# Altium schematic sheet DBG BOOT_CONF.SchDoc
size A2; DrawnBy: UKAYACIK; Engineer: UKAYACIK; DocumentNumber: 20; SheetNumber: 20; SheetTotal: 21
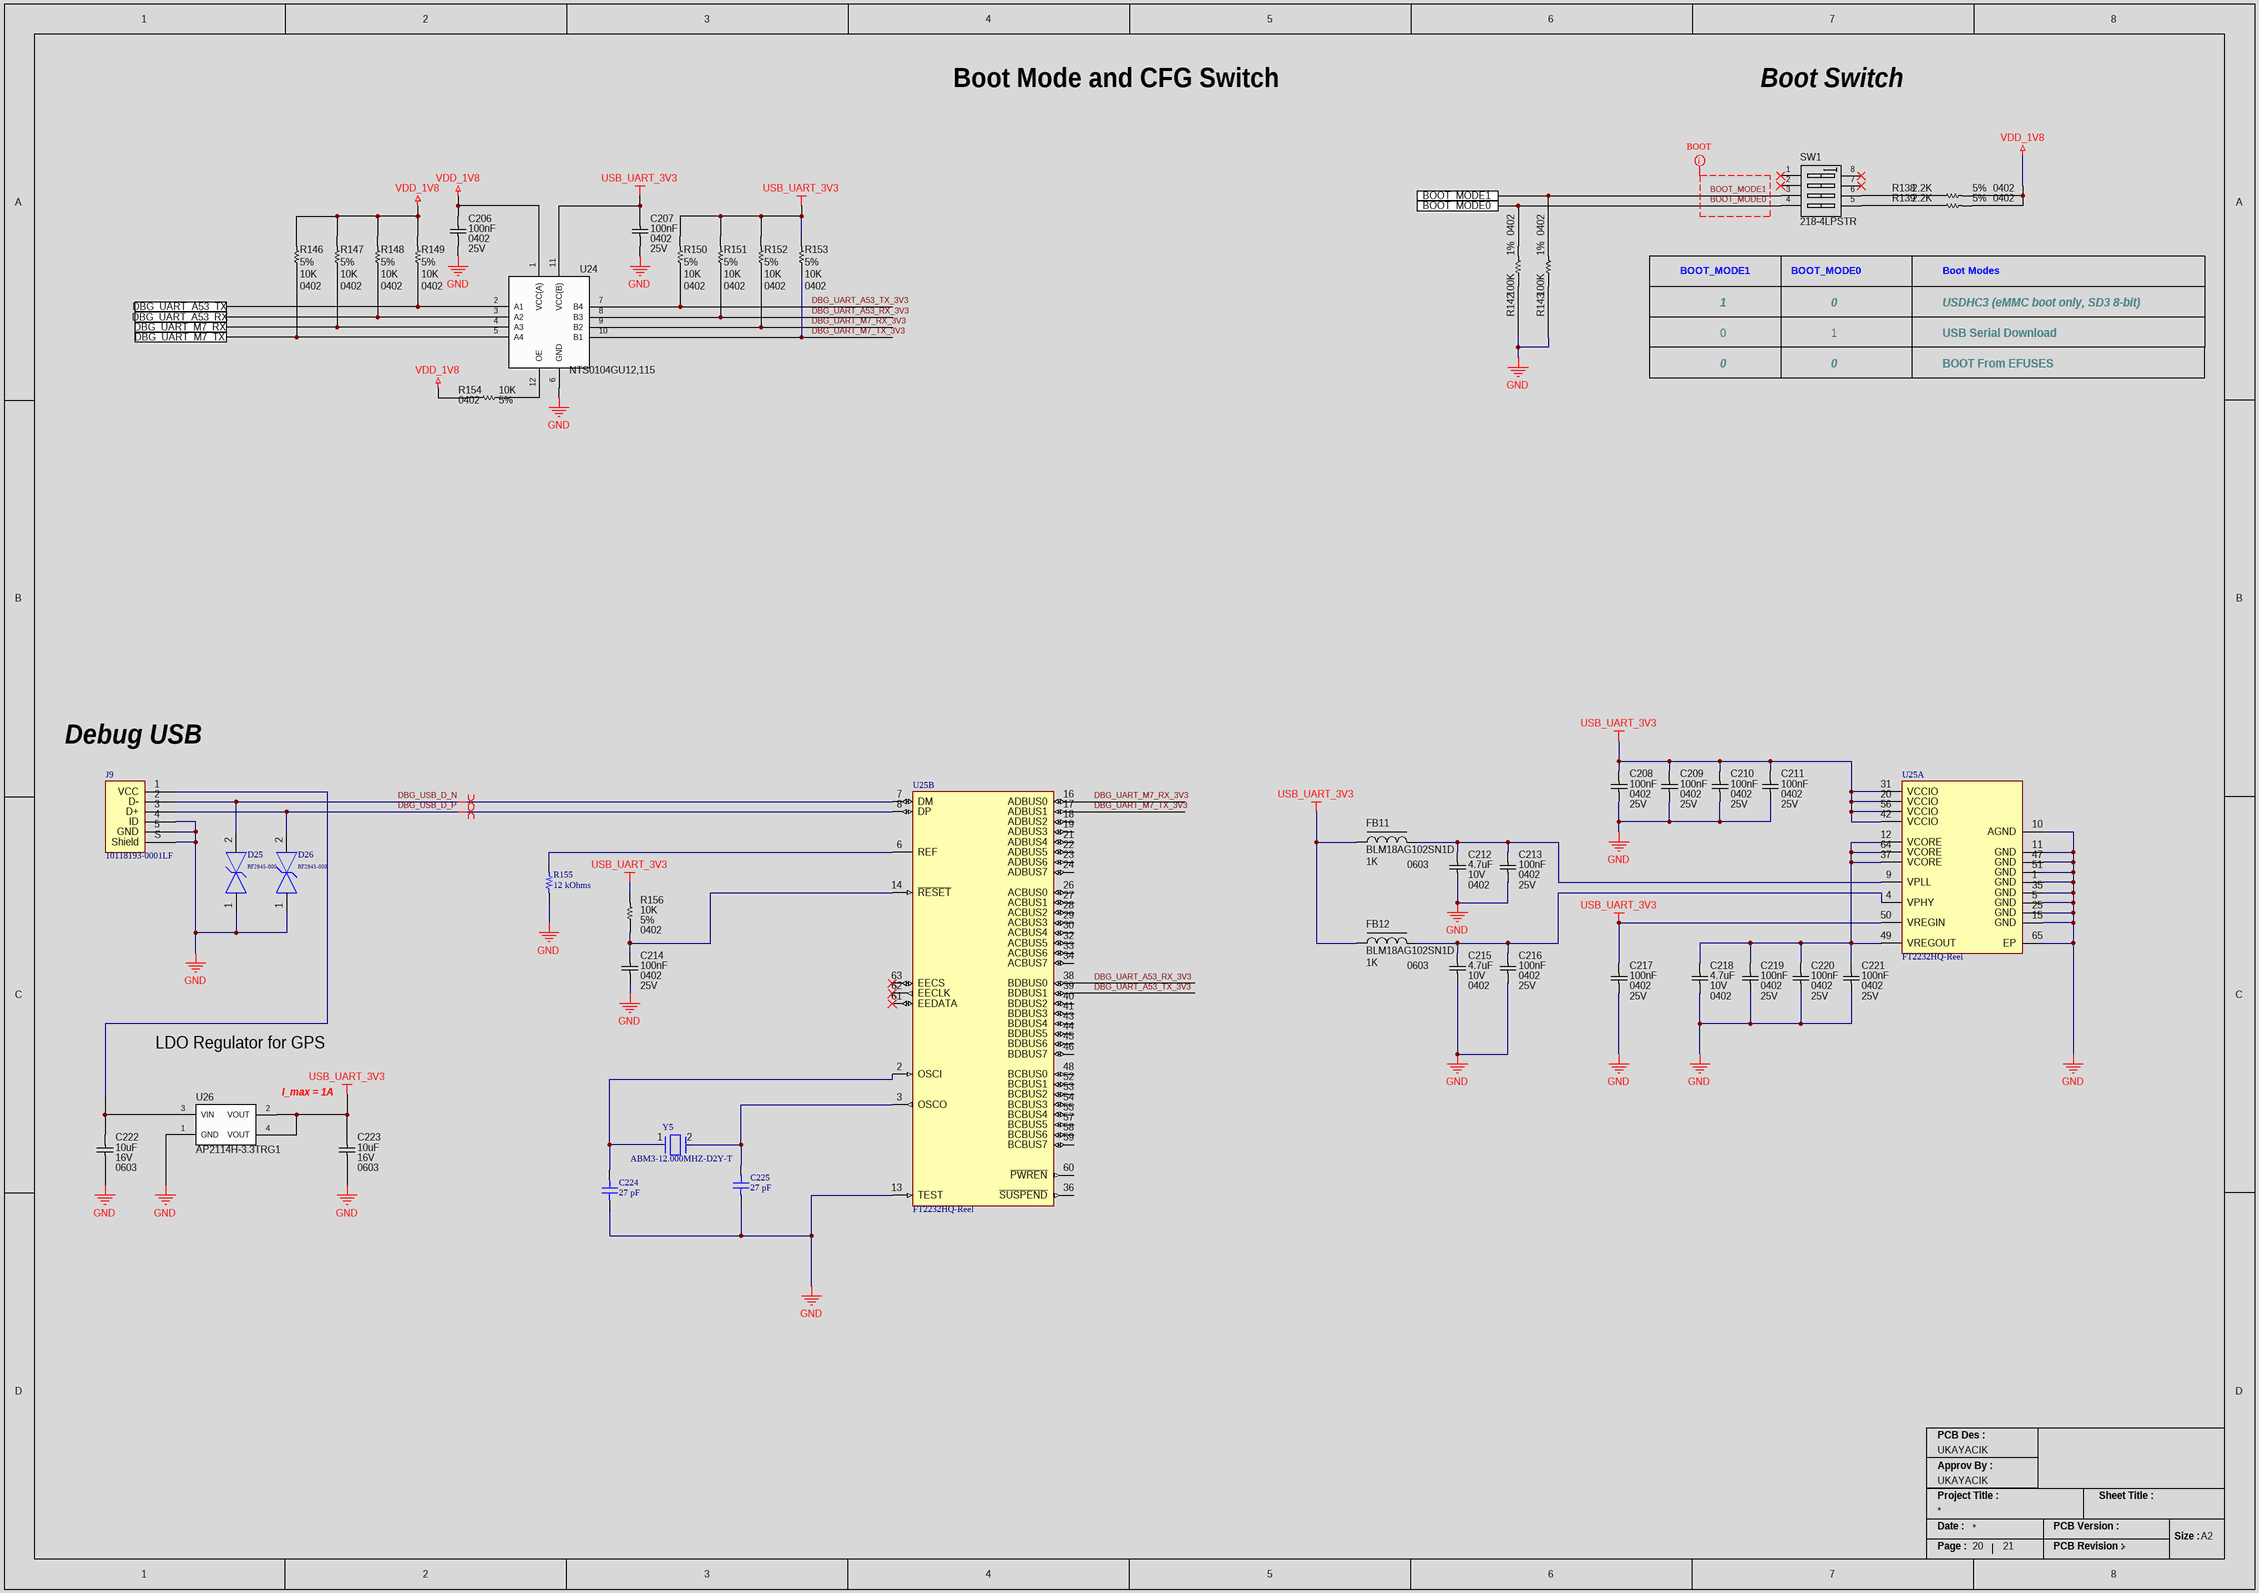
[diagram p0: DBG BOOT_CONF.SchDoc]

## Parts
C206  Capacitance: 100nF  Voltage Rating: 25V  Case/Package: 0402  [CAP_0402_CAPC1005X05N]  (hidden comment: CC0402KRX5R8BB104)
C207  Capacitance: 100nF  Voltage Rating: 25V  Case/Package: 0402  [CAP_0402_CAPC1005X05N]  (hidden comment: CC0402KRX5R8BB104)
C208  Capacitance: 100nF  Voltage Rating: 25V  Case/Package: 0402  [CAP_0402_CAPC1005X05N]  (hidden comment: CC0402KRX5R8BB104)
C209  Capacitance: 100nF  Voltage Rating: 25V  Case/Package: 0402  [CAP_0402_CAPC1005X05N]  (hidden comment: CC0402KRX5R8BB104)
C210  Capacitance: 100nF  Voltage Rating: 25V  Case/Package: 0402  [CAP_0402_CAPC1005X05N]  (hidden comment: CC0402KRX5R8BB104)
C211  Capacitance: 100nF  Voltage Rating: 25V  Case/Package: 0402  [CAP_0402_CAPC1005X05N]  (hidden comment: CC0402KRX5R8BB104)
C212  Capacitance: 4.7uF  Voltage Rating: 10V  Case/Package: 0402  [CAP_0402_CAPC1005X05N]  (hidden comment: CL05A475KP5NRNC)
C213  Capacitance: 100nF  Voltage Rating: 25V  Case/Package: 0402  [CAP_0402_CAPC1005X05N]  (hidden comment: CC0402KRX5R8BB104)
C214  Capacitance: 100nF  Voltage Rating: 25V  Case/Package: 0402  [CAP_0402_CAPC1005X05N]  (hidden comment: CC0402KRX5R8BB104)
C215  Capacitance: 4.7uF  Voltage Rating: 10V  Case/Package: 0402  [CAP_0402_CAPC1005X05N]  (hidden comment: CL05A475KP5NRNC)
C216  Capacitance: 100nF  Voltage Rating: 25V  Case/Package: 0402  [CAP_0402_CAPC1005X05N]  (hidden comment: CC0402KRX5R8BB104)
C217  Capacitance: 100nF  Voltage Rating: 25V  Case/Package: 0402  [CAP_0402_CAPC1005X05N]  (hidden comment: CC0402KRX5R8BB104)
C218  Capacitance: 4.7uF  Voltage Rating: 10V  Case/Package: 0402  [CAP_0402_CAPC1005X05N]  (hidden comment: CL05A475KP5NRNC)
C219  Capacitance: 100nF  Voltage Rating: 25V  Case/Package: 0402  [CAP_0402_CAPC1005X05N]  (hidden comment: CC0402KRX5R8BB104)
C220  Capacitance: 100nF  Voltage Rating: 25V  Case/Package: 0402  [CAP_0402_CAPC1005X05N]  (hidden comment: CC0402KRX5R8BB104)
C221  Capacitance: 100nF  Voltage Rating: 25V  Case/Package: 0402  [CAP_0402_CAPC1005X05N]  (hidden comment: CC0402KRX5R8BB104)
C222  Voltage Rating: 16V  Capacitance: 10uF  Case/Package: 0603  [CAP_0603_CAPC1608X08N]  (hidden comment: GRM188R61C106MAALD)
C223  Voltage Rating: 16V  Capacitance: 10uF  Case/Package: 0603  [CAP_0603_CAPC1608X08N]  (hidden comment: GRM188R61C106MAALD)
C224  27 pF  [CAP 0402_1005]
C225  27 pF  [CAP 0402_1005]
D25  RF2945-000  [FP-SESD0402-MFG]
D26  RF2945-000  [FP-SESD0402-MFG]
FB11  BLM18AG102SN1D  Impedance: 1K  Case/Package: 0603  [IND_0603_INDC1608X08N]
FB12  BLM18AG102SN1D  Impedance: 1K  Case/Package: 0603  [IND_0603_INDC1608X08N]
J9  10118193-0001LF  [FCI USB 10118193-0001LF]
R138  Tolerance: 5%  Resistance: 2.2K  Case/Package: 0402  [RES_0402_RESC1005X04N]  (hidden comment: RC0402JR-072K2L)
R139  Tolerance: 5%  Resistance: 2.2K  Case/Package: 0402  [RES_0402_RESC1005X04N]  (hidden comment: RC0402JR-072K2L)
R142  Resistance: 100K  Tolerance: 1%  Case/Package: 0402  [RES_0402_RESC1005X04N]  (hidden comment: RC0402FR-07100KL)
R143  Resistance: 100K  Tolerance: 1%  Case/Package: 0402  [RES_0402_RESC1005X04N]  (hidden comment: RC0402FR-07100KL)
R146  Tolerance: 5%  Resistance: 10K  Case/Package: 0402  [RES_0402_RESC1005X04N]  (hidden comment: ERJ-2GEJ103X)
R147  Tolerance: 5%  Resistance: 10K  Case/Package: 0402  [RES_0402_RESC1005X04N]  (hidden comment: ERJ-2GEJ103X)
R148  Tolerance: 5%  Resistance: 10K  Case/Package: 0402  [RES_0402_RESC1005X04N]  (hidden comment: ERJ-2GEJ103X)
R149  Tolerance: 5%  Resistance: 10K  Case/Package: 0402  [RES_0402_RESC1005X04N]  (hidden comment: ERJ-2GEJ103X)
R150  Tolerance: 5%  Resistance: 10K  Case/Package: 0402  [RES_0402_RESC1005X04N]  (hidden comment: ERJ-2GEJ103X)
R151  Tolerance: 5%  Resistance: 10K  Case/Package: 0402  [RES_0402_RESC1005X04N]  (hidden comment: ERJ-2GEJ103X)
R152  Tolerance: 5%  Resistance: 10K  Case/Package: 0402  [RES_0402_RESC1005X04N]  (hidden comment: ERJ-2GEJ103X)
R153  Tolerance: 5%  Resistance: 10K  Case/Package: 0402  [RES_0402_RESC1005X04N]  (hidden comment: ERJ-2GEJ103X)
R154  Tolerance: 5%  Resistance: 10K  Case/Package: 0402  [RES_0402_RESC1005X04N]  (hidden comment: ERJ-2GEJ103X)
R155  12 kOhms  [RES 0402_1005]
R156  Tolerance: 5%  Resistance: 10K  Case/Package: 0402  [RES_0402_RESC1005X04N]  (hidden comment: ERJ-2GEJ103X)
SW1  218-4LPSTR  [SW_DIP_SOIC127P844X265-8N]
U24  NTS0104GU12,115  [IC_LEVEL_TRASLATOR_XQFN12_0P4_1P8X2P1]
U25  FT2232HQ-Reel  [FP-FT2232HQ-Reel-MFG]  (parts A,B of 2)
U26  AP2114H-3.3TRG1  [IC_REG_SOT230P700X180-4N]
Y5  ABM3-12.000MHZ-D2Y-T  [FP-ABM3-MFG]

## Ports
BOOT_MODE0, BOOT_MODE1, DBG_UART_A53_RX, DBG_UART_A53_TX, DBG_UART_M7_RX, DBG_UART_M7_TX

## Nets
GND: C206.1 C207.1 C208.1 C209.1 C210.1 C211.1 C212.1 C213.1 C214.1 C215.1 C216.1 C217.1 C218.1 C219.1 C220.1 C221.1 C222.1 C223.1 C224.1 C225.1 D25.1 D26.1 J9.4(ID) J9.5(GND) J9.S(Shield) R142.1 R143.1 R155.1 U24.6(GND) U25.1(GND) U25.5(GND) U25.10(AGND) U25.11(GND) U25.13(TEST) U25.15(GND) U25.25(GND) U25.35(GND) U25.47(GND) U25.51(GND) U25.65(EP) U26.1(GND)
USB_UART_3V3: C207.2 C208.2 C209.2 C210.2 C211.2 C217.2 C223.2 FB11.1 FB12.1 R150.2 R151.2 R152.2 R153.2 R156.2 U24.11(VCC(B)) U25.20(VCCIO) U25.31(VCCIO) U25.42(VCCIO) U25.50(VREGIN) U25.56(VCCIO) U26.2(VOUT) U26.4(VOUT)
VDD_1V8: C206.2 R138.2 R139.2 R146.2 R147.2 R148.2 R149.2 R154.1 U24.1(VCC(A))
BOOT_MODE0: R142.2 SW1.4(A4) ; port BOOT_MODE0
BOOT_MODE1: R143.2 SW1.3(A3) ; port BOOT_MODE1
DBG_UART_A53_RX: R148.1 U24.3(A2) ; port DBG_UART_A53_RX
DBG_UART_A53_RX_3V3: R151.1 U24.8(B3) U25.38(BDBUS0)
DBG_UART_A53_TX: R149.1 U24.2(A1) ; port DBG_UART_A53_TX
DBG_UART_A53_TX_3V3: R150.1 U24.7(B4) U25.39(BDBUS1)
DBG_UART_M7_RX: R147.1 U24.4(A3) ; port DBG_UART_M7_RX
DBG_UART_M7_RX_3V3: R152.1 U24.9(B2) U25.16(ADBUS0)
DBG_UART_M7_TX: R146.1 U24.5(A4) ; port DBG_UART_M7_TX
DBG_UART_M7_TX_3V3: R153.1 U24.10(B1) U25.17(ADBUS1)
DBG_USB_D_N: D25.2 J9.2(D-) U25.7(DM)
DBG_USB_D_P: D26.2 J9.3(D+) U25.8(DP)
NetC212_2: C212.2 C213.2 FB11.2 U25.9(VPLL)
NetC214_2: C214.2 R156.1 U25.14(~{RESET})
NetC215_2: C215.2 C216.2 FB12.2 U25.4(VPHY)
NetC218_2: C218.2 C219.2 C220.2 C221.2 U25.12(VCORE) U25.37(VCORE) U25.49(VREGOUT) U25.64(VCORE)
NetC222_2: C222.2 J9.1(VCC) U26.3(VIN)
NetC224_2: C224.2 U25.2(OSCI) Y5.1
NetC225_2: C225.2 U25.3(OSCO) Y5.2
NetR138_1: R138.1 SW1.6(B3)
NetR139_1: R139.1 SW1.5(B4)
NetR154_2: R154.2 U24.12(OE)
NetR155_2: R155.2 U25.6(REF)

Not connected (* = marked no-connect by the designer): SW1 1(A1)* 2(A2)* 7(B2)* 8(B1)*; U25 18(ADBUS2) 19(ADBUS3) 21(ADBUS4) 22(ADBUS5) 23(ADBUS6) 24(ADBUS7) 26(ACBUS0) 27(ACBUS1) 28(ACBUS2) 29(ACBUS3) 30(ACBUS4) 32(ACBUS5) 33(ACBUS6) 34(ACBUS7) 36(~{SUSPEND}) 40(BDBUS2) 41(BDBUS3) 43(BDBUS4) 44(BDBUS5) 45(BDBUS6) 46(BDBUS7) 48(BCBUS0) 52(BCBUS1) 53(BCBUS2) 54(BCBUS3) 55(BCBUS4) 57(BCBUS5) 58(BCBUS6) 59(BCBUS7) 60(~{PWREN}) 61(EEDATA)* 62(EECLK)* 63(EECS)*

## Layout directives
mark named BOOT: BOOT_MODE0, BOOT_MODE1
differential pair; differential pair class Z90: DBG_USB_D_N, DBG_USB_D_P

## Notes on the sheet
- Boot Mode and CFG Switch
- Boot Switch
- BOOT_MODE1
- BOOT_MODE0
- Boot Modes
- 1
- 0
- USDHC3 (eMMC boot only, SD3 8-bit)
- USB Serial Download
- BOOT From EFUSES
- Debug USB
- LDO Regulator for GPS
- I_max = 1A
- PCB Des :
- Approv By :
- Project Title :
- Sheet Title :
- Date :
- Page :
- PCB Version :
- PCB Revision :
- Size :
- A2

## Library data of the parts
C206-C211 C213 C214 C216 C217 C219-C221 = CAP_100NF_25V_X7R_0402: Multilayer Ceramic Capacitor, 0.1 uF, 25 V, ± 10%, X7R, 0402 [1005 Metric]; Manufacturer: Yageo; Material: 4241ConductorMaterial; Dielectric: X5R; Temperature Coefficient: 30ppm/°C; Supplier 1: Digikey; Manufacturer Part Number: CC0402KRX5R8BB104; RoHS: Yes; Category: Ceramic Capacitors; Stock 1: 3706055; Pricing 1: 1=0.1, 10=0.037, 50=0.021, 100=0.0162, 500=0.01224, 1000=0.00961, 2500=0.00874, 5000=0.00804 (USD); Mount: Surface Mount; Case Code (Metric): 1005; Case Code (Imperial): 0402; Min Operating Temperature: -55°C; Max Operating Temperature: 85°C; Tolerance: 10%; Packaging: Tape and Reel; Voltage Rating (DC): 25V; Series: CC; RoHS Compliant: Yes; Lead Free: 5697LeadFree; Halogen Free: 5694HalogenFree; ComponentLink1URL: http://www.mouser.com/ds/2/447/UPY-GPHC_X5R_4V-to-50V_25-1131599.pdf?src-supplier=Mouser; ComponentLink1Description: http://www.mouser.com/ds/2/447/UPY-GPHC_X5R_4V-to-50V_25-1131599.pdf?src-supplier=Mouser; ComponentLink2URL: https://datasheet.octopart.com/CC0402KRX5R8BB104-Yageo-datasheet-137700082.pdf?src-supplier=Future+Electronics; ComponentLink2Description: https://datasheet.octopart.com/CC0402KRX5R8BB104-Yageo-datasheet-137700082.pdf?src-supplier=Future+Electronics; ComponentLink3URL: http://www.yageo.com/documents/recent/UPY-GPHC_X5R_4V-to-50V_25.pdf?src-supplier=Digikey; ComponentLink3Description: http://www.yageo.com/documents/recent/UPY-GPHC_X5R_4V-to-50V_25.pdf?src-supplier=Digikey; ComponentLink4URL: https://datasheet.octopart.com/CC0402KRX5R8BB104-Yageo-datasheet-140260304.pdf?src-supplier=Newark; ComponentLink4Description: https://datasheet.octopart.com/CC0402KRX5R8BB104-Yageo-datasheet-140260304.pdf?src-supplier=Newark; ComponentLink5URL: https://datasheet.octopart.com/CC0402KRX5R8BB104-Yageo-datasheet-170350636.pdf?src-supplier=Future+Electronics; ComponentLink5Description: https://datasheet.octopart.com/CC0402KRX5R8BB104-Yageo-datasheet-170350636.pdf?src-supplier=Future+Electronics; ComponentLink6URL: http://www.yageo.com/documents/recent/UPY-GPHC_X5R_4V-to-50V-16.pdf?src-supplier=Future+Electronics; ComponentLink6Description: http://www.yageo.com/documents/recent/UPY-GPHC_X5R_4V-to-50V-16.pdf?src-supplier=Future+Electronics; Supplier Part Number 1: 311-1697-6-ND
C212 C215 C218 = CAP_4.7UF_10V_X5R_0402: Multilayer Ceramic Capacitor, 4.7 uF, 10 V, ± 10%, X5R, 0402 [1005 Metric]; Manufacturer: Samsung; Supplier 1: Digikey; Manufacturer Part Number: CL05A475KP5NRNC; RoHS: Yes; Category: Ceramic Capacitors; Stock 1: 748042; Pricing 1: 1=0.28, 10=0.184, 50=0.129, 100=0.1042, 500=0.0774, 1000=0.06772, 2500=0.0645, 5000=0.05966 (USD); Mount: Surface Mount; Case Code (Metric): 1005; Case Code (Imperial): 0402; Material: Ceramic; Min Operating Temperature: -55°C; Max Operating Temperature: 85°C; Tolerance: 10%; Packaging: Tape and Reel; Package Quantity: 1; Dielectric: X5R; Series: CL; Construction: Flat; Length: 1mm; Width: 0.02inch; Height: 0.5mm; Thickness: 0.022inch; Depth: 0.5mm; Radiation Hardening: No; RoHS Compliant: Yes; Lead Free: Lead Free; ComponentLink1URL: https://datasheet.ciiva.com/25724/cl05a475kp5nrnc-25724404.pdf?src-supplier=Digikey; ComponentLink1Description: https://datasheet.ciiva.com/25724/cl05a475kp5nrnc-25724404.pdf?src-supplier=Digikey; ComponentLink2URL: https://datasheet.ciiva.com/29198/458873-da-01-en-vs-kondensator-0402-29198304.pdf?src-supplier=Conrad; ComponentLink2Description: https://datasheet.ciiva.com/29198/458873-da-01-en-vs-kondensator-0402-29198304.pdf?src-supplier=Conrad; Supplier Part Number 1: 1276-1480-1-ND
C222 C223 = CAP_10UF_16V_X5R_0603: 0603 10 uF 16 V ±20% Tolerance X5R Multilayer Ceramic Chip Capacitor; Manufacturer: Murata; Manufacturer Part Number: GRM188R61C106MAALD; RoHS: Yes; Category: Ceramic Capacitors; Stock 1: 566627; Pricing 1: 1=0.24000, 10=0.16500, 50=0.11000, 100=0.09340, 500=0.06596, 1000=0.05771 (USD); Mount: Surface Mount; Case Code (Metric): 1608; Material: Ceramic; Case Code (Imperial): 0603; Min Operating Temperature: -55°C; Max Operating Temperature: 85°C; Tolerance: 20%; Packaging: Cut Tape; Voltage Rating (DC): 16V; Length: 0.063inch; Width: 0.031inch; Height: 0.8mm; Thickness: 0.037inch; Lead Free: Lead Free; RoHS Compliant: Yes; ComponentLink1URL: http://search.murata.co.jp/Ceramy/image/img/A01X/G101/ENG/GRM188R61C106MAAL-01.pdf?src-supplier=Digi-Key; ComponentLink1Description: http://search.murata.co.jp/Ceramy/image/img/A01X/G101/ENG/GRM188R61C106MAAL-01.pdf?src-supplier=Digi-Key; ComponentLink2URL: https://search.murata.co.jp/Ceramy/image/img/A01X/G101/ENG/GRM188R61C106MAAL-01.pdf?src-supplier=Digi-Key; ComponentLink2Description: https://search.murata.co.jp/Ceramy/image/img/A01X/G101/ENG/GRM188R61C106MAAL-01.pdf?src-supplier=Digi-Key; ComponentLink3URL: http://search.murata.co.jp/Ceramy/image/img/A01X/partnumbering_e_01.pdf?src-supplier=Digi-Key; ComponentLink3Description: http://search.murata.co.jp/Ceramy/image/img/A01X/partnumbering_e_01.pdf?src-supplier=Digi-Key; Supplier 1: Digi-Key; Supplier 2: Verical; Supplier 3: Mouser; Supplier Part Number 1: 490-10729-1-ND; Supplier Part Number 2: GRM188R61C106MAALD; Supplier Part Number 3: 81-GRM188R61C106MALD
C224 C225 = 0402N270J250CT: CAP CER 27PF 25V C0G/NP0 0402; manufacturer: Walsin Technology Corporation; Temperature Coefficient: C0G, NP0; Tolerance: ±5%; Part Number: 0402N270J250CT; Capacitance: 27 pF; Applications: General Purpose; componentlink1description: Datasheet; componentlink1url: http://www.passivecomponent.com/wp-content/uploads/2018/10/MLCC.pdf; componentlink2description: DigiKey Link; componentlink2url: https://www.digikey.com/en/products/detail/walsin-technology-corporation/0402N270J250CT/9354788; Device Package: 0402 (1005 Metric); lastupdated: 2/9/2024 8:04:36 PM; Lifecycle Status: Active; Minimum Order: 1; Mounting Type: Surface Mount, MLCC; Operating Temperature: -55°C ~ 125°C; Package / Case: 0402 (1005 Metric); packaging: CutTape; partid: 2638; Part Status: Active; price: 0.01; series: -; Size / Dimension: 0.039" L x 0.020" W (1.00mm x 0.50mm); Supplier 1: DigiKey; Supplier Part Number 1: 1292-1291-1-ND; Thickness (Max): 0.022" (0.55mm); value: 27 pF; Voltage - Rated: 25V
D25 D26 = CMP-08607-000062-1: TVS DIODE 7V 10V 0402; Manufacturer: Littelfuse; Value: 0.1pF; Breakdown Voltage: 9.8V; Number Of Channels: 1; Peak Pulse Current: 2A; Direction: Bidirectional; Automotive Grade: Grade 1; Standoff Height: 0mm; Octopart: https://octopart.com/rf2945-000-littelfuse-56516902; Device Class L3: unset; ComponentLink2Description: Datasheet; Lead Free: Yes; Temperature Range Low: -55°C; Clamping Voltage: 10V; Digikey Description: TVS DIODE 7V 10V 0402; Category: Diode; Temperature: -55°C to +125°C; Device Class L1: Circuit Protection; Capacitance: 0.1pF; RoHS: TRUE; Device Class L2: TVS Diodes; Package: SESD0402; Reverse Standoff Voltage: 7V; Automotive: Yes; Height: 0.43mm; Manufacturer Part Number: RF2945-000; Temperature Range High: +125°C; ComponentLink2URL: https://www.littelfuse.com/~/media/electronics/datasheets/tvs_diode_arrays/littelfuse_tvs_diode_array_sesd_ultra_low_capacitance_discrete_tvs_datasheet.pdf.pdf
FB11 FB12 = IND_FERRITA_1K_450mA_BLM18AG102SN1D: Ferrite Beads Multi-Layer 1KOhm 25% 100MHz 450mA 500mOhm DCR 0603 T/R; Manufacturer: Murata; Material: Steel,Ferrite; Max DC Current: 400mA; DC Resistance (DCR): 500mR; Number of Lines: 1; Shielding: Unshielded; DC Resistance-Max: 700mR; Supplier 1: Digikey; Manufacturer Part Number: BLM18AG102SN1D; RoHS: Yes; Category: Ferrite Beads and Chips; Stock 1: 632067; Pricing 1: 1=0.1, 10=0.074, 25=0.0676, 50=0.0608, 100=0.0445, 250=0.0324, 500=0.02968, 1000=0.02564 (USD); Number of Pins: 2; Core Material: Ferrite; Case Code (Metric): 1608; Case Code (Imperial): 0603; Min Operating Temperature: -55°C; Max Operating Temperature: 125°C; Tolerance: 25%; Package Quantity: 1; Resistance: 500mR; Packaging: Tape and Reel; Current Rating: 400mA; Max Current Rating: 400mA; Termination: SMD/SMT; Test Frequency: 100MHz; DC Current: 400mA; Frequency: 100MHz; Number of Circuits: 1; Series: BLM18A; RMS Current (Irms): 450mA; Series Resistance: 500mR; Length: 1.6mm; Width: 0.8mm; Height: 0.8mm; Depth: 0.8mm; Radiation Hardening: No; Reach SVHC Compliant: No; Military Standard: Not; Lead Free: Lead Free; RoHS Compliant: Yes; ComponentLink1URL: https://datasheet.ciiva.com/1012/l0110s0100blm18a-1012016.pdf?src-supplier=Digikey; ComponentLink1Description: https://datasheet.ciiva.com/1012/l0110s0100blm18a-1012016.pdf?src-supplier=Digikey; ComponentLink2URL: https://datasheet.ciiva.com/5709/1756147-5709056.pdf?src-supplier=Farnell; ComponentLink2Description: https://datasheet.ciiva.com/5709/1756147-5709056.pdf?src-supplier=Farnell; ComponentLink3URL: https://datasheet.ciiva.com/11795/0900766b80032ea2-11795437.pdf?src-supplier=Rs; ComponentLink3Description: https://datasheet.ciiva.com/11795/0900766b80032ea2-11795437.pdf?src-supplier=Rs; ComponentLink4URL: https://datasheet.ciiva.com/29347/442253-da-01-en-chip-drossel-0603-1000r-400ma-1-6x0-8mm-29347887.pdf?src-supplier=Conrad; ComponentLink4Description: https://datasheet.ciiva.com/29347/442253-da-01-en-chip-drossel-0603-1000r-400ma-1-6x0-8mm-29347887.pdf?src-supplier=Conrad; ComponentLink5URL: https://datasheet.ciiva.com/41449/001172220-da-01-en-drossel-0603-1000r-1-6x0-8mm-4000st-41449508.pdf?src-supplier=Conrad; ComponentLink5Description: https://datasheet.ciiva.com/41449/001172220-da-01-en-drossel-0603-1000r-1-6x0-8mm-4000st-41449508.pdf?src-supplier=Conrad; ComponentLink6URL: https://datasheet.ciiva.com/1012/l0110s0100blm18a-1012014.pdf?src-supplier=Digikey; ComponentLink6Description: https://datasheet.ciiva.com/1012/l0110s0100blm18a-1012014.pdf?src-supplier=Digikey; ComponentLink7URL: https://datasheet.ciiva.com/1012/l0110s0100blm18a-1012015.pdf?src-supplier=Digikey; ComponentLink7Description: https://datasheet.ciiva.com/1012/l0110s0100blm18a-1012015.pdf?src-supplier=Digikey; ComponentLink8URL: https://datasheet.ciiva.com/16199/l0110s0100blm18a-16199225.pdf?src-supplier=Future+Electronics; ComponentLink8Description: https://datasheet.ciiva.com/16199/l0110s0100blm18a-16199225.pdf?src-supplier=Future+Electronics; ComponentLink9URL: https://datasheet.ciiva.com/8510/l0110s0100blm18a-8510154.pdf?src-supplier=Avnet; ComponentLink9Description: https://datasheet.ciiva.com/8510/l0110s0100blm18a-8510154.pdf?src-supplier=Avnet; ComponentLink10URL: https://datasheet.ciiva.com/1466/1756147-1466919.pdf?src-supplier=Element14; ComponentLink10Description: https://datasheet.ciiva.com/1466/1756147-1466919.pdf?src-supplier=Element14; ComponentLink11URL: https://datasheet.ciiva.com/1466/1756147-1466920.pdf?src-supplier=Element14; ComponentLink11Description: https://datasheet.ciiva.com/1466/1756147-1466920.pdf?src-supplier=Element14; Supplier Part Number 1: 490-1015-1-ND
J9 = 10118193-0001LF: CONN RCPT USB2.0 MICRO B SMD R/A; Manufacturer: Amphenol ICC (FCI); Connector Type: USB - micro B; Current Rating (Amps): 1.8A per Contact; Gender: Receptacle; Mating Cycles: 10000; Number of Contacts: 5; Number of Ports: 1; Shielding: Shielded; Voltage - Rated: 100VAC; Part Number: 10118193-0001LF; ComponentLink1Description: Datasheet; ComponentLink1URL: https://cdn.amphenol-icc.com/media/wysiwyg/files/documentation/datasheet/inputoutput/io_usb_micro.pdf; ComponentLink2Description: DigiKey Link; ComponentLink2URL: //digikey.com/product-detail/en/amphenol-icc-fci/10118193-0001LF/609-4616-2-ND/2785388; Features: Solder Retention; LastUpdated: 12/9/2019 8:51:28 PM; Lifecycle Status: 0; Minimum Order: 1; Mounting Feature: Horizontal; Mounting Type: Surface Mount, Right Angle; Through Hole; Operating Temperature: -30°C ~ 80°C; Packaging: TapeAndReel; Part Status: Active; Price: 0.21; Series: -; Specifications: USB 2.0; Supplier 1: DigiKey; Supplier Part Number 1: 609-4616-2-ND; Termination: Solder
R138 R139 = RES_2.2K_5%_63mW_0402: SMD Chip Resistor, 2.2 kOhm, ± 5%, 63 mW, 0402 [1005 Metric], Thick Film, General Purpose; Manufacturer: Yageo; Power Rating: 62.5mW; Voltage Rating: 50V; Temperature Coefficient: 100ppm/°C; Max Power Dissipation: 63mW; Supplier 1: Mouser; Manufacturer Part Number: RC0402JR-072K2L; RoHS: Yes; Category: Chip SMD Resistors; Stock 1: 27488; Pricing 1: 1=0.1, 10=0.011, 50=0.011, 100=0.006, 1000=0.005, 10000=0.002 (USD); Case Code (Metric): 1005; Case Code (Imperial): 0402; Weight: 2.3E-05oz; Min Operating Temperature: -55°C; Max Operating Temperature: 155°C; Package Quantity: 1; Packaging: Tape and Reel; Resistor Type: Thick Film; Number of Terminations: 2; Termination: SMD/SMT; Working Voltage: 50V; Features: Moisture Resistant; Series: RC; Resistance Tolerance: 5%; Construction: Rectangular; Technology: THICK FILM; Voltage Rating (AC): 50V; Length: 1mm; Width: 0.02inch; Height: 0.016inch; Depth: 0.5mm; Reach SVHC Compliant: No; Military Standard: Not; RoHS Compliant: Yes; Lead Free: 5697LeadFree; ComponentLink1URL: https://datasheet.ciiva.com/2518/pyu-r-int-thick-7-2518881.pdf?src-supplier=Digikey; ComponentLink1Description: https://datasheet.ciiva.com/2518/pyu-r-int-thick-7-2518881.pdf?src-supplier=Digikey; ComponentLink2URL: https://datasheet.ciiva.com/2518/pyu-r-int-thick-7-2518882.pdf?src-supplier=Digikey; ComponentLink2Description: https://datasheet.ciiva.com/2518/pyu-r-int-thick-7-2518882.pdf?src-supplier=Digikey; ComponentLink3URL: https://datasheet.ciiva.com/2518/pyu-r-int-thick-7-2518880.pdf?src-supplier=Digikey; ComponentLink3Description: https://datasheet.ciiva.com/2518/pyu-r-int-thick-7-2518880.pdf?src-supplier=Digikey; ComponentLink4URL: https://datasheet.ciiva.com/12577/pyu-rc0402-51-rohs-l-6-r-12577433.pdf?src-supplier=Mouser; ComponentLink4Description: https://datasheet.ciiva.com/12577/pyu-rc0402-51-rohs-l-6-r-12577433.pdf?src-supplier=Mouser; ComponentLink5URL: https://datasheet.ciiva.com/7850/1018594-7850191.pdf?src-supplier=Element14; ComponentLink5Description: https://datasheet.ciiva.com/7850/1018594-7850191.pdf?src-supplier=Element14; ComponentLink6URL: https://datasheet.ciiva.com/7850/1018594-7850190.pdf?src-supplier=Element14; ComponentLink6Description: https://datasheet.ciiva.com/7850/1018594-7850190.pdf?src-supplier=Element14; ComponentLink7URL: https://datasheet.ciiva.com/16741/pyu-rc0402-51-rohs-l-6-r-16741086.pdf?src-supplier=Future+Electronics; ComponentLink7Description: https://datasheet.ciiva.com/16741/pyu-rc0402-51-rohs-l-6-r-16741086.pdf?src-supplier=Future+Electronics; ComponentLink8URL: https://datasheet.ciiva.com/15189/getdatasheetpartid-327800-15189558.pdf?src-supplier=Verical; ComponentLink8Description: https://datasheet.ciiva.com/15189/getdatasheetpartid-327800-15189558.pdf?src-supplier=Verical; Supplier Part Number 1: 603-RC0402JR-072K2L
R142 R143 = RES_100K_1%_100mW_0402: SMD Chip Resistor, 100 kOhm, ± 1%, 63 mW, 0402 [1005 Metric], Thick Film, General Purpose; Manufacturer: Yageo; Temperature Coefficient: 100ppm/°C; Power Rating: 63mW; Voltage Rating: 50V; Supplier 1: Digi-Key; Manufacturer Part Number: RC0402FR-07100KL; RoHS: Yes; Category: Chip SMD Resistors; Stock 1: 27579413; Pricing 1: 1=0.1, 10=0.014, 50=0.0084, 100=0.007, 500=0.00464, 1000=0.00396, 5000=0.00282 (USD); Case Code (Metric): 1005; Case Code (Imperial): 0402; Min Operating Temperature: -55°C; Max Operating Temperature: 155°C; Resistor Type: Thick Film; Packaging: Tape and Reel; Package Quantity: 1; Number of Terminations: 2; Termination: SMD/SMT; Max Power Dissipation: 63mW; Features: Moisture Resistant; Series: RC; Resistance Tolerance: 1%; Construction: Rectangular; Technology: THICK FILM; Voltage Rating (AC): 50V; Length: 0.039inch; Width: 0.02inch; Height: 0.016inch; Depth: 0.5mm; Reach SVHC Compliant: No; RoHS Compliant: Yes; Lead Free: 5697LeadFree; Military Standard: Not; ComponentLink1URL: https://datasheet.ciiva.com/11819/0900766b80c66297-11819452.pdf?src-supplier=Rs; ComponentLink1Description: https://datasheet.ciiva.com/11819/0900766b80c66297-11819452.pdf?src-supplier=Rs; ComponentLink2URL: https://datasheet.ciiva.com/22747/1018594-22747509.pdf?src-supplier=Element14; ComponentLink2Description: https://datasheet.ciiva.com/22747/1018594-22747509.pdf?src-supplier=Element14; ComponentLink3URL: https://datasheet.ciiva.com/2453/pyu-r-int-thick-7-2453362.pdf?src-supplier=Digi-Key; ComponentLink3Description: https://datasheet.ciiva.com/2453/pyu-r-int-thick-7-2453362.pdf?src-supplier=Digi-Key; ComponentLink4URL: https://datasheet.ciiva.com/12667/pyu-rc0402-51-rohs-l-6-r-12667930.pdf?src-supplier=Mouser; ComponentLink4Description: https://datasheet.ciiva.com/12667/pyu-rc0402-51-rohs-l-6-r-12667930.pdf?src-supplier=Mouser; ComponentLink5URL: https://datasheet.ciiva.com/15189/getdatasheetpartid-323696-15189334.pdf?src-supplier=Verical; ComponentLink5Description: https://datasheet.ciiva.com/15189/getdatasheetpartid-323696-15189334.pdf?src-supplier=Verical; ComponentLink6URL: https://datasheet.ciiva.com/2453/pyu-r-int-thick-7-2453363.pdf?src-supplier=Digi-Key; ComponentLink6Description: https://datasheet.ciiva.com/2453/pyu-r-int-thick-7-2453363.pdf?src-supplier=Digi-Key; ComponentLink7URL: https://datasheet.ciiva.com/2453/pyu-r-int-thick-7-2453361.pdf?src-supplier=Digi-Key; ComponentLink7Description: https://datasheet.ciiva.com/2453/pyu-r-int-thick-7-2453361.pdf?src-supplier=Digi-Key; Supplier Part Number 1: 311-100KLRCT-ND
R146-R154 R156 = RES_10K_5%_100mW_0402: Res Thick Film 0402 10K Ohm 5% 1/10W ±200ppm/°C Molded SMD Punched Carrier T/R; Manufacturer: Panasonic; Power Rating: 100mW; Voltage Rating: 50V; Supplier 1: Digi-Key; Manufacturer Part Number: ERJ-2GEJ103X; RoHS: Yes; Category: Chip SMD Resistors; Stock 1: 4696986; Pricing 1: 1=0.1, 10=0.021, 50=0.0132, 100=0.011, 500=0.00744, 1000=0.00639, 5000=0.00464 (USD); Mount: Surface Mount; Contact Plating: Tin; Case Code (Metric): 1005; Case Code (Imperial): 0402; Size Code: 0402; Min Operating Temperature: -55°C; Max Operating Temperature: 155°C; Temperature Coefficient: 200ppm/°C; Packaging: Cut Tape; Resistor Type: Thick Film; Package Quantity: 10000; Number of Terminations: 2; Termination: SMD/SMT; Max Power Dissipation: 100mW; Features: Automotive AEC-Q200; Series: ERJ; Resistance Tolerance: 5%; Technology: THICK FILM; Voltage Rating (DC): 50V; Length: 1mm; Width: 0.5mm; Height: 0.35mm; Depth: 0.5mm; Ratings: AEC-Q200; Radiation Hardening: No; Reach SVHC Compliant: No; RoHS Compliant: Yes; Lead Free: 5697LeadFree; ComponentLink1URL: https://datasheet.ciiva.com/27055/1935721-27055112.pdf?src-supplier=Jameco; ComponentLink1Description: https://datasheet.ciiva.com/27055/1935721-27055112.pdf?src-supplier=Jameco; ComponentLink2URL: https://datasheet.ciiva.com/11821/0900766b80f806dd-11821170.pdf?src-supplier=Rs; ComponentLink2Description: https://datasheet.ciiva.com/11821/0900766b80f806dd-11821170.pdf?src-supplier=Rs; ComponentLink3URL: https://datasheet.ciiva.com/43460/1678796-43460391.pdf?src-supplier=Farnell; ComponentLink3Description: https://datasheet.ciiva.com/43460/1678796-43460391.pdf?src-supplier=Farnell; ComponentLink4URL: https://datasheet.ciiva.com/22785/1678796-22785949.pdf?src-supplier=Farnell; ComponentLink4Description: https://datasheet.ciiva.com/22785/1678796-22785949.pdf?src-supplier=Farnell; ComponentLink5URL: https://datasheet.ciiva.com/46371/1678796-46371910.pdf?src-supplier=Element14; ComponentLink5Description: https://datasheet.ciiva.com/46371/1678796-46371910.pdf?src-supplier=Element14; ComponentLink6URL: https://datasheet.ciiva.com/28514/1678796-28514154.pdf?src-supplier=Element14; ComponentLink6Description: https://datasheet.ciiva.com/28514/1678796-28514154.pdf?src-supplier=Element14; ComponentLink7URL: https://datasheet.ciiva.com/24070/aoa0000ce1-37422-24070679.pdf?src-supplier=Mouser; ComponentLink7Description: https://datasheet.ciiva.com/24070/aoa0000ce1-37422-24070679.pdf?src-supplier=Mouser; ComponentLink8URL: https://datasheet.ciiva.com/16767/70260739-16767130.pdf?src-supplier=Allied+Electronics; ComponentLink8Description: https://datasheet.ciiva.com/16767/70260739-16767130.pdf?src-supplier=Allied+Electronics; ComponentLink9URL: https://datasheet.ciiva.com/16774/70260739-16774504.pdf?src-supplier=Allied+Electronics; ComponentLink9Description: https://datasheet.ciiva.com/16774/70260739-16774504.pdf?src-supplier=Allied+Electronics; ComponentLink10URL: https://datasheet.ciiva.com/9194/aoa0000ce1-9194140.pdf?src-supplier=Avnet; ComponentLink10Description: https://datasheet.ciiva.com/9194/aoa0000ce1-9194140.pdf?src-supplier=Avnet; Supplier Part Number 1: P10KJCT-ND
R155 = RMCF0402FT12K0: RES 12K OHM 1% 1/16W 0402; Manufacturer: Stackpole Electronics Inc; Power (Watts): 0.063W, 1/16W; Temperature Coefficient: ±100ppm/°C; Part Number: RMCF0402FT12K0; Value: 12 kOhms; ComponentLink1Description: Datasheet; ComponentLink1URL: https://www.seielect.com/catalog/sei-rmcf_rmcp.pdf; ComponentLink2Description: DigiKey Link; ComponentLink2URL: https://www.digikey.com/en/products/detail/stackpole-electronics-inc/RMCF0402FT12K0/1714419; Composition: Thick Film; Device Package: 0402 (1005 Metric); Features: Automotive AEC-Q200; Height - Seated (Max): 0.016" (0.40mm); LastUpdated: 2/9/2024 8:30:16 PM; Lifecycle Status: Active; Minimum Order: 1; Number of Terminations: 2; Operating Temperature: -55°C ~ 155°C; Package / Case: 0402 (1005 Metric); Packaging: CutTape; PartId: 4499; Part Status: Active; Price: 0.01; Ratings: AEC-Q200; Resistance: 12 kOhms; Series: RMCF; Size / Dimension: 0.039" L x 0.020" W (1.00mm x 0.50mm); Supplier 1: DigiKey; Supplier Part Number 1: RMCF0402FT12K0CT-ND; Supplier Device Package: 0402; Tolerance: ±1%
SW1 = SWITCH_DIP_4P_25mA_218-4LPSTR: Switch DIP ON OFF SPST 4 Recessed Slide 0.025A 24VDC Gull Wing 1000Cycles 1.27mm SMD T/R; Manufacturer: CTS; Number of Positions: 4; Voltage Rating (DC): 24V; Actuator Type: Slide (Standard); Max Current Rating: 25mA; Washable: Yes; Supplier 1: Digi-Key; Manufacturer Part Number: 218-4LPSTR; RoHS: Yes; Category: DIP Switches; Stock 1: 12605; Pricing 1: 1=1.08, 10=1.041, 25=0.978, 100=0.8449, 250=0.76996, 500=0.71586, 1000=0.66592 (USD); Mount: Surface Mount; Contact Material: Copper; Contact Plating: Gold; Mechanical Life: 1000Cycles; Min Operating Temperature: -55°C; Max Operating Temperature: 85°C; Throw Configuration: SPST; Packaging: Tape and Reel; Electrical Life: 1000Cycles; Series: 218; Max Voltage Rating (DC): 24V; Termination: Gull Wing; Orientation: Straight; Package Quantity: 2000; Length: 6.25mm; Depth: 8.44mm; Radiation Hardening: No; Lead Free: Lead Free; RoHS Compliant: Yes; ComponentLink1URL: https://datasheet.ciiva.com/8676/218-8676896.pdf?src-supplier=Avnet; ComponentLink1Description: https://datasheet.ciiva.com/8676/218-8676896.pdf?src-supplier=Avnet; ComponentLink2URL: https://datasheet.ciiva.com/8082/218-8082342.pdf?src-supplier=Avnet; ComponentLink2Description: https://datasheet.ciiva.com/8082/218-8082342.pdf?src-supplier=Avnet; ComponentLink3URL: https://datasheet.ciiva.com/16303/218-16303941.pdf?src-supplier=Future+Electronics; ComponentLink3Description: https://datasheet.ciiva.com/16303/218-16303941.pdf?src-supplier=Future+Electronics; ComponentLink4URL: https://datasheet.ciiva.com/15184/getdatasheetpartid-141001-15184860.pdf?src-supplier=Verical; ComponentLink4Description: https://datasheet.ciiva.com/15184/getdatasheetpartid-141001-15184860.pdf?src-supplier=Verical; Supplier Part Number 1: CT3110CT-ND
U24 = IC_LEVEL_TRASLATOR_NTS0104GU12,115: NTS0104 Series 50 Mbps Dual Supply 3-ST O-DRN Translating Transceiver- XQFN-12; Manufacturer: NXP Semiconductors; Logic Function: Translator; Low Level Output Current: 1mA; High Level Output Current: -20uA; Quiescent Current: 45uA; Data Rate: 50Mbps; Number of Channels: 4; Propagation Delay: 4.4ns; Max Supply Voltage: 5.5V; Min Supply Voltage: 1.65V; Max Power Dissipation: 250mW; Turn-On Delay Time: 5.8ns; Output Type: Voltage; Supplier 1: Digikey; Manufacturer Part Number: NTS0104GU12,115; RoHS: Yes; Category: Voltage Level Shifters; Stock 1: 126626; Pricing 1: 1=1.16, 10=1.034, 25=0.982, 100=0.8065, 250=0.75396, 500=0.66628, 1000=0.52601 (USD); Mount: Surface Mount; Number of Pins: 12; Min Operating Temperature: -40°C; Max Operating Temperature: 125°C; Packaging: Tape and Reel; Package Quantity: 1; Number of Bits: 4; Series: -; Lead Free: Lead Free; RoHS Compliant: Yes; ComponentLink1URL: https://datasheet.ciiva.com/1899/nts0104-1899088.pdf?src-supplier=Digikey; ComponentLink1Description: https://datasheet.ciiva.com/1899/nts0104-1899088.pdf?src-supplier=Digikey; ComponentLink2URL: https://datasheet.ciiva.com/4834/nts0104-92130-4834865.pdf?src-supplier=Mouser; ComponentLink2Description: https://datasheet.ciiva.com/4834/nts0104-92130-4834865.pdf?src-supplier=Mouser; ComponentLink3URL: https://datasheet.ciiva.com/1899/nts0104-1899089.pdf?src-supplier=Digikey; ComponentLink3Description: https://datasheet.ciiva.com/1899/nts0104-1899089.pdf?src-supplier=Digikey; ComponentLink4URL: https://datasheet.ciiva.com/1899/nts0104-1899090.pdf?src-supplier=Digikey; ComponentLink4Description: https://datasheet.ciiva.com/1899/nts0104-1899090.pdf?src-supplier=Digikey; ComponentLink5URL: https://datasheet.ciiva.com/8244/nts0104-8244168.pdf?src-supplier=Avnet; ComponentLink5Description: https://datasheet.ciiva.com/8244/nts0104-8244168.pdf?src-supplier=Avnet; Supplier Part Number 1: 568-8408-1-ND
U25 = CMP-0078-00004-5: IC USB HS DUAL UART/FIFO 64-QFN; Manufacturer: FTDI; Min Supply Voltage: 1.62V; Ciiva Ids: 1315829; Nominal Supply Current: 5-70mA; Standoff Height: 0mm; Import Ts: 1521843541; Number Of Ports: 1; Max Supply Voltage: 3.63V; Data Rate: 480Mbits/s; Interface: I2C,SPI,UART,USB,RS-232,RS-485,RS-422,Other; Usb Standard: USB 2.0; Octopart: https://octopart.com/ft2232hq-reel-ftdi-19172126; Ipc Land Pattern Name: QFN50P900X900X85-64; Ambient Temperature Range High: +85°C; RoHS: TRUE; Manufacturer Part Number: FT2232HQ-Reel; Automotive: No; Footprint Url: https://www.ftdichip.com/Support/Documents/TechnicalNotes/TN_166%20FTDI%20Example%20IC%20PCB%20Footprints.pdf; Temperature Range High: +85°C; ComponentLink2Description: Datasheet; Ambient Temperature Range Low: -40°C; Mouser Description: USB Interface IC USB HS to Dual UART/ FIFO/SPI/JTAG/I2C; ComponentLink2URL: https://www.ftdichip.com/Support/Documents/DataSheets/ICs/DS_FT2232H.pdf; Digikey Description: IC USB HS DUAL UART/FIFO 64-QFN; Release Date: 1383921489; Height: 0.9mm; Lead Free: Yes; Package: QFN64; Device Class L1: Integrated Circuits (ICs); Temperature: -40°C to +85°C; Temperature Range Low: -40°C; Category: IC; Device Class L2: Interface ICs; Device Class L3: USB Interface ICs
U26 = IC_REG_LDO_3.3V_1A_AP2114H-3.3TRG1: IC REG LDO 3.3V 1A SOT223; Manufacturer: Diodes; Supplier 1: Digikey; Manufacturer Part Number: AP2114H-3.3TRG1; RoHS: Yes; Category: Voltage Regulators - Linear; Stock 1: 34610; Pricing 1: 1=0.41, 10=0.332, 25=0.304, 100=0.2262, 250=0.20504, 500=0.16968, 1000=0.12726 (USD); ComponentLink1URL: https://datasheet.ciiva.com/29569/ap2114-29569881.pdf?src-supplier=Digikey; ComponentLink1Description: https://datasheet.ciiva.com/29569/ap2114-29569881.pdf?src-supplier=Digikey; ComponentLink2URL: https://datasheet.ciiva.com/29569/ap2114-29569882.pdf?src-supplier=Digikey; ComponentLink2Description: https://datasheet.ciiva.com/29569/ap2114-29569882.pdf?src-supplier=Digikey; ComponentLink3URL: https://datasheet.ciiva.com/29569/ap2114-29569883.pdf?src-supplier=Digikey; ComponentLink3Description: https://datasheet.ciiva.com/29569/ap2114-29569883.pdf?src-supplier=Digikey; Supplier Part Number 1: AP2114H-3.3TRG1DICT-ND
Y5 = CMP-27762-007917-1: Crystal 12MHz ±20ppm 18pF SMD-2 5mm x 3.2mm; ESR (Equivalent Series Resistance): 60R; Frequency Stability: 30ppm; Depth: 3.2mm; Length: 5mm; Height: 0.051inch; Case/Package: CSMD; Package Quantity: 1000; Frequency: 12MHz; Packaging: Tape and Reel; Load Capacitance: 18pF; Min Operating Temperature: -40°C; Operating Frequency: 12 MHz; Number of Pins: 2; Termination: SMD/SMT; Tolerance: 20ppm; Mount: Surface Mount; Width: 0.126inch; Resistor Type: Ceramic; Frequency Tolerance: 20ppm; Lead Free: Lead Free; Max Operating Temperature: 85°C; Radiation Hardening: No; Series Resistance: 60R; Series: ABM3